# EAGLE design backplane (EAGLE 5.12)

## Sheet 1 of 3
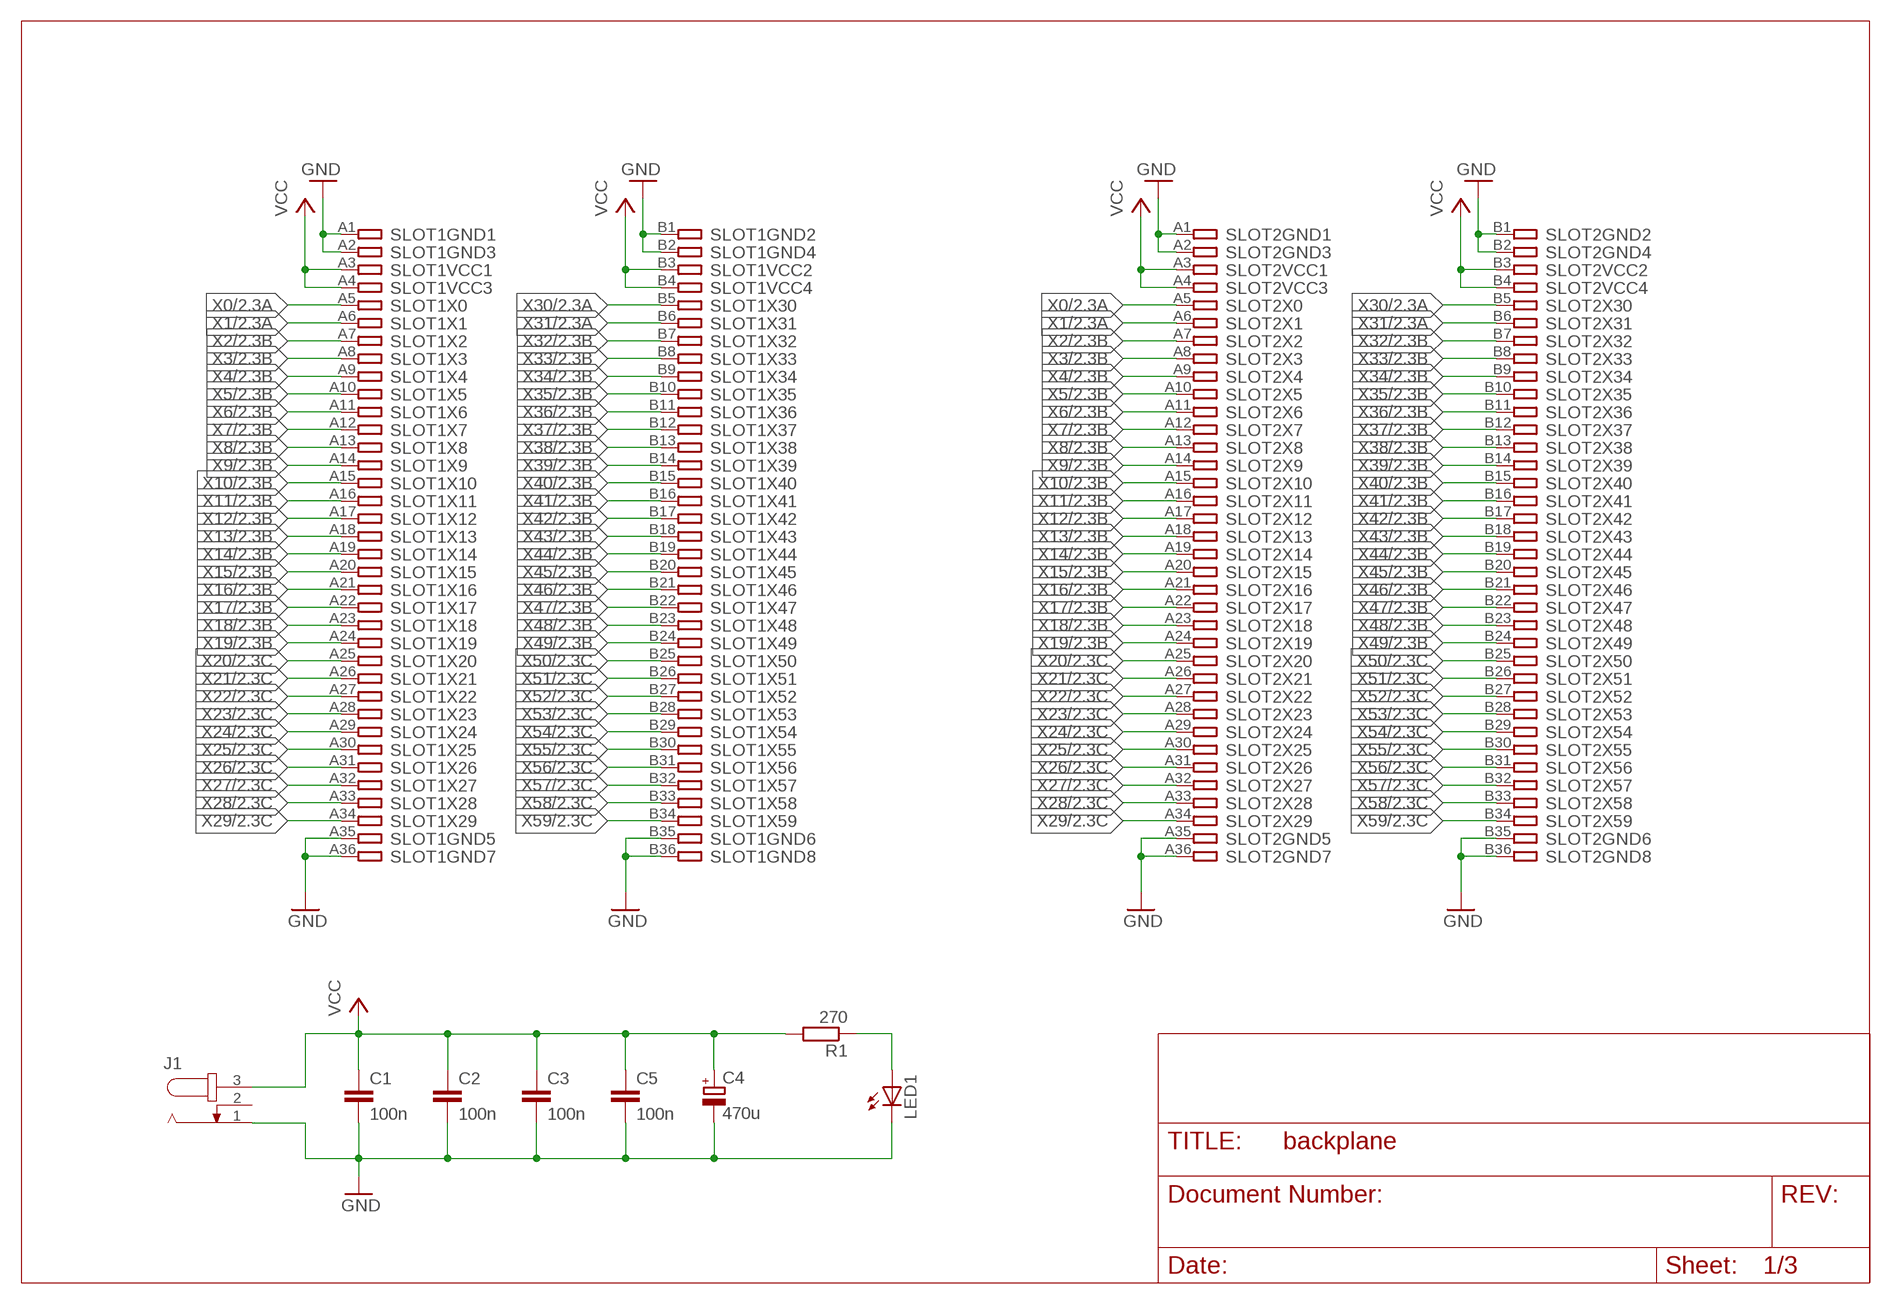
[diagram p0: schematic, sheet 1]

### Parts
C1  100n  C-EU050-024X044  [C050-024X044]
C2  100n  C-EU050-024X044  [C050-024X044]
C3  100n  C-EU050-024X044  [C050-024X044]
C4  470u  CPOL-EUE3.5-8  [E3,5-8]
C5  100n  C-EU050-024X044  [C050-024X044]
J1  JACK-PLUG0  [SPC4077]
LED1  LED5MM  [LED5MM]
R1  270  R-EU_0207/7  [0207/7]
SLOT1  MINI8086_SLOT  [CON-72]
SLOT2  MINI8086_SLOT  [CON-72]

### Nets
GND: C1.2 C2.2 C3.2 C4.- C5.2 J1.1 LED1.K(C) SLOT1.A1 SLOT1.A2 SLOT1.A35 SLOT1.A36 SLOT1.B1 SLOT1.B2 SLOT1.B35 SLOT1.B36 SLOT2.A1 SLOT2.A2 SLOT2.A35 SLOT2.A36 SLOT2.B1 SLOT2.B2 SLOT2.B35 SLOT2.B36 ; also sheet 2,3
N$3: LED1.A R1.1
VCC: C1.1 C2.1 C3.1 C4.+ C5.1 J1.3 R1.2 SLOT1.A3 SLOT1.A4 SLOT1.B3 SLOT1.B4 SLOT2.A3 SLOT2.A4 SLOT2.B3 SLOT2.B4 ; also sheet 2,3
X0: SLOT1.A5 SLOT2.A5 ; also sheet 2,3
X1: SLOT1.A6 SLOT2.A6 ; also sheet 2,3
X2: SLOT1.A7 SLOT2.A7 ; also sheet 2,3
X3: SLOT1.A8 SLOT2.A8 ; also sheet 2,3
X4: SLOT1.A9 SLOT2.A9 ; also sheet 2,3
X5: SLOT1.A10 SLOT2.A10 ; also sheet 2,3
X6: SLOT1.A11 SLOT2.A11 ; also sheet 2,3
X7: SLOT1.A12 SLOT2.A12 ; also sheet 2,3
X8: SLOT1.A13 SLOT2.A13 ; also sheet 2,3
X9: SLOT1.A14 SLOT2.A14 ; also sheet 2,3
X10: SLOT1.A15 SLOT2.A15 ; also sheet 2,3
X11: SLOT1.A16 SLOT2.A16 ; also sheet 2,3
X12: SLOT1.A17 SLOT2.A17 ; also sheet 2,3
X13: SLOT1.A18 SLOT2.A18 ; also sheet 2,3
X14: SLOT1.A19 SLOT2.A19 ; also sheet 2,3
X15: SLOT1.A20 SLOT2.A20 ; also sheet 2,3
X16: SLOT1.A21 SLOT2.A21 ; also sheet 2,3
X17: SLOT1.A22 SLOT2.A22 ; also sheet 2,3
X18: SLOT1.A23 SLOT2.A23 ; also sheet 2,3
X19: SLOT1.A24 SLOT2.A24 ; also sheet 2,3
X20: SLOT1.A25 SLOT2.A25 ; also sheet 2,3
X21: SLOT1.A26 SLOT2.A26 ; also sheet 2,3
X22: SLOT1.A27 SLOT2.A27 ; also sheet 2,3
X23: SLOT1.A28 SLOT2.A28 ; also sheet 2,3
X24: SLOT1.A29 SLOT2.A29 ; also sheet 2,3
X25: SLOT1.A30 SLOT2.A30 ; also sheet 2,3
X26: SLOT1.A31 SLOT2.A31 ; also sheet 2,3
X27: SLOT1.A32 SLOT2.A32 ; also sheet 2,3
X28: SLOT1.A33 SLOT2.A33 ; also sheet 2,3
X29: SLOT1.A34 SLOT2.A34 ; also sheet 2,3
X30: SLOT1.B5 SLOT2.B5 ; also sheet 2,3
X31: SLOT1.B6 SLOT2.B6 ; also sheet 2,3
X32: SLOT1.B7 SLOT2.B7 ; also sheet 2,3
X33: SLOT1.B8 SLOT2.B8 ; also sheet 2,3
X34: SLOT1.B9 SLOT2.B9 ; also sheet 2,3
X35: SLOT1.B10 SLOT2.B10 ; also sheet 2,3
X36: SLOT1.B11 SLOT2.B11 ; also sheet 2,3
X37: SLOT1.B12 SLOT2.B12 ; also sheet 2,3
X38: SLOT1.B13 SLOT2.B13 ; also sheet 2,3
X39: SLOT1.B14 SLOT2.B14 ; also sheet 2,3
X40: SLOT1.B15 SLOT2.B15 ; also sheet 2,3
X41: SLOT1.B16 SLOT2.B16 ; also sheet 2,3
X42: SLOT1.B17 SLOT2.B17 ; also sheet 2,3
X43: SLOT1.B18 SLOT2.B18 ; also sheet 2,3
X44: SLOT1.B19 SLOT2.B19 ; also sheet 2,3
X45: SLOT1.B20 SLOT2.B20 ; also sheet 2,3
X46: SLOT1.B21 SLOT2.B21 ; also sheet 2,3
X47: SLOT1.B22 SLOT2.B22 ; also sheet 2,3
X48: SLOT1.B23 SLOT2.B23 ; also sheet 2,3
X49: SLOT1.B24 SLOT2.B24 ; also sheet 2,3
X50: SLOT1.B25 SLOT2.B25 ; also sheet 2,3
X51: SLOT1.B26 SLOT2.B26 ; also sheet 2,3
X52: SLOT1.B27 SLOT2.B27 ; also sheet 2,3
X53: SLOT1.B28 SLOT2.B28 ; also sheet 2,3
X54: SLOT1.B29 SLOT2.B29 ; also sheet 2,3
X55: SLOT1.B30 SLOT2.B30 ; also sheet 2,3
X56: SLOT1.B31 SLOT2.B31 ; also sheet 2,3
X57: SLOT1.B32 SLOT2.B32 ; also sheet 2,3
X58: SLOT1.B33 SLOT2.B33 ; also sheet 2,3
X59: SLOT1.B34 SLOT2.B34 ; also sheet 2,3
Unconnected: J1.2

## Sheet 2 of 3
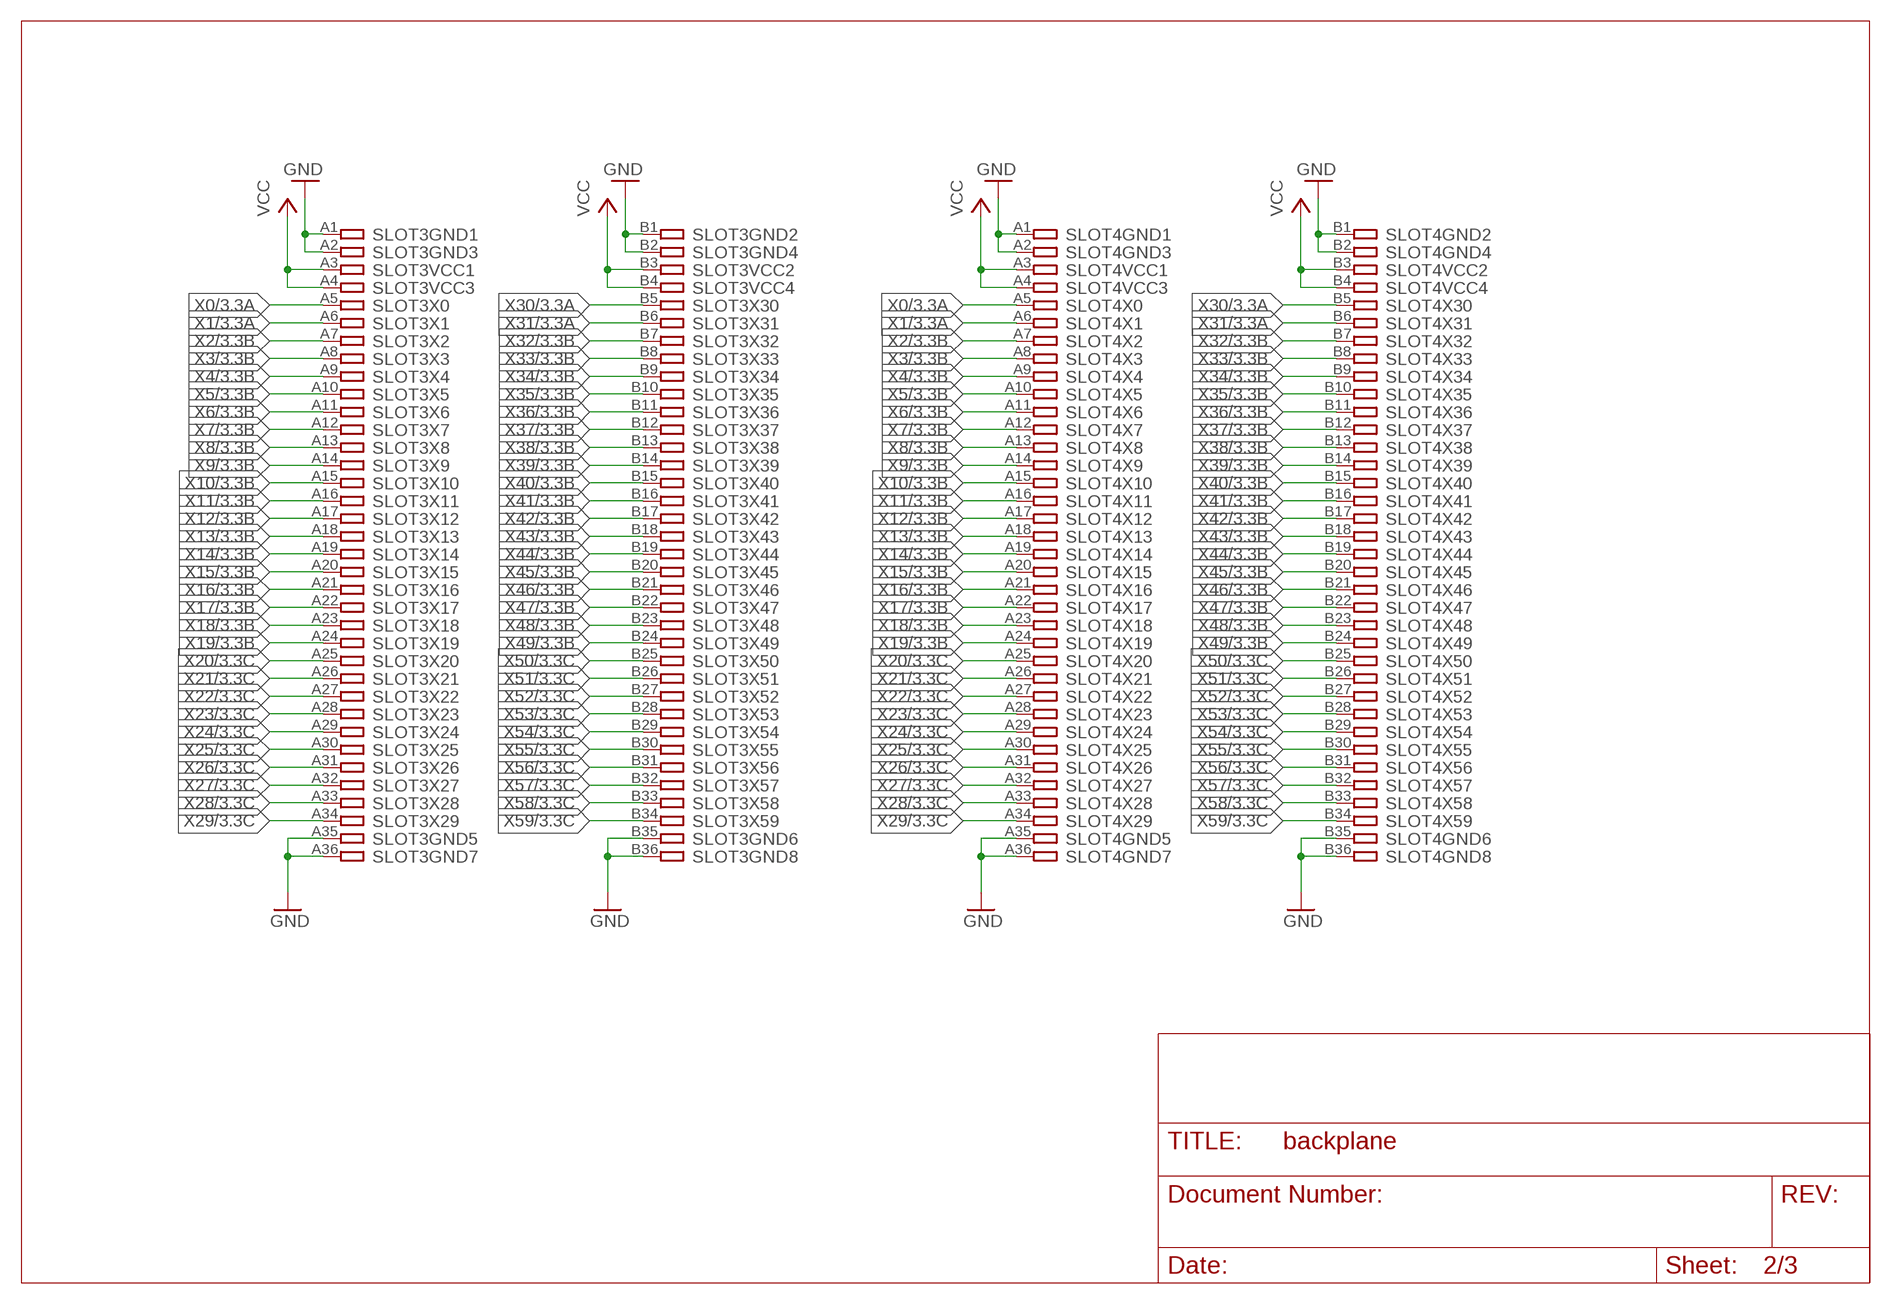
[diagram p1: schematic, sheet 2]

### Parts
SLOT3  MINI8086_SLOT  [CON-72]
SLOT4  MINI8086_SLOT  [CON-72]

### Nets
GND: SLOT3.A1 SLOT3.A2 SLOT3.A35 SLOT3.A36 SLOT3.B1 SLOT3.B2 SLOT3.B35 SLOT3.B36 SLOT4.A1 SLOT4.A2 SLOT4.A35 SLOT4.A36 SLOT4.B1 SLOT4.B2 SLOT4.B35 SLOT4.B36 ; also sheet 1,3
VCC: SLOT3.A3 SLOT3.A4 SLOT3.B3 SLOT3.B4 SLOT4.A3 SLOT4.A4 SLOT4.B3 SLOT4.B4 ; also sheet 1,3
X0: SLOT3.A5 SLOT4.A5 ; also sheet 1,3
X1: SLOT3.A6 SLOT4.A6 ; also sheet 1,3
X2: SLOT3.A7 SLOT4.A7 ; also sheet 1,3
X3: SLOT3.A8 SLOT4.A8 ; also sheet 1,3
X4: SLOT3.A9 SLOT4.A9 ; also sheet 1,3
X5: SLOT3.A10 SLOT4.A10 ; also sheet 1,3
X6: SLOT3.A11 SLOT4.A11 ; also sheet 1,3
X7: SLOT3.A12 SLOT4.A12 ; also sheet 1,3
X8: SLOT3.A13 SLOT4.A13 ; also sheet 1,3
X9: SLOT3.A14 SLOT4.A14 ; also sheet 1,3
X10: SLOT3.A15 SLOT4.A15 ; also sheet 1,3
X11: SLOT3.A16 SLOT4.A16 ; also sheet 1,3
X12: SLOT3.A17 SLOT4.A17 ; also sheet 1,3
X13: SLOT3.A18 SLOT4.A18 ; also sheet 1,3
X14: SLOT3.A19 SLOT4.A19 ; also sheet 1,3
X15: SLOT3.A20 SLOT4.A20 ; also sheet 1,3
X16: SLOT3.A21 SLOT4.A21 ; also sheet 1,3
X17: SLOT3.A22 SLOT4.A22 ; also sheet 1,3
X18: SLOT3.A23 SLOT4.A23 ; also sheet 1,3
X19: SLOT3.A24 SLOT4.A24 ; also sheet 1,3
X20: SLOT3.A25 SLOT4.A25 ; also sheet 1,3
X21: SLOT3.A26 SLOT4.A26 ; also sheet 1,3
X22: SLOT3.A27 SLOT4.A27 ; also sheet 1,3
X23: SLOT3.A28 SLOT4.A28 ; also sheet 1,3
X24: SLOT3.A29 SLOT4.A29 ; also sheet 1,3
X25: SLOT3.A30 SLOT4.A30 ; also sheet 1,3
X26: SLOT3.A31 SLOT4.A31 ; also sheet 1,3
X27: SLOT3.A32 SLOT4.A32 ; also sheet 1,3
X28: SLOT3.A33 SLOT4.A33 ; also sheet 1,3
X29: SLOT3.A34 SLOT4.A34 ; also sheet 1,3
X30: SLOT3.B5 SLOT4.B5 ; also sheet 1,3
X31: SLOT3.B6 SLOT4.B6 ; also sheet 1,3
X32: SLOT3.B7 SLOT4.B7 ; also sheet 1,3
X33: SLOT3.B8 SLOT4.B8 ; also sheet 1,3
X34: SLOT3.B9 SLOT4.B9 ; also sheet 1,3
X35: SLOT3.B10 SLOT4.B10 ; also sheet 1,3
X36: SLOT3.B11 SLOT4.B11 ; also sheet 1,3
X37: SLOT3.B12 SLOT4.B12 ; also sheet 1,3
X38: SLOT3.B13 SLOT4.B13 ; also sheet 1,3
X39: SLOT3.B14 SLOT4.B14 ; also sheet 1,3
X40: SLOT3.B15 SLOT4.B15 ; also sheet 1,3
X41: SLOT3.B16 SLOT4.B16 ; also sheet 1,3
X42: SLOT3.B17 SLOT4.B17 ; also sheet 1,3
X43: SLOT3.B18 SLOT4.B18 ; also sheet 1,3
X44: SLOT3.B19 SLOT4.B19 ; also sheet 1,3
X45: SLOT3.B20 SLOT4.B20 ; also sheet 1,3
X46: SLOT3.B21 SLOT4.B21 ; also sheet 1,3
X47: SLOT3.B22 SLOT4.B22 ; also sheet 1,3
X48: SLOT3.B23 SLOT4.B23 ; also sheet 1,3
X49: SLOT3.B24 SLOT4.B24 ; also sheet 1,3
X50: SLOT3.B25 SLOT4.B25 ; also sheet 1,3
X51: SLOT3.B26 SLOT4.B26 ; also sheet 1,3
X52: SLOT3.B27 SLOT4.B27 ; also sheet 1,3
X53: SLOT3.B28 SLOT4.B28 ; also sheet 1,3
X54: SLOT3.B29 SLOT4.B29 ; also sheet 1,3
X55: SLOT3.B30 SLOT4.B30 ; also sheet 1,3
X56: SLOT3.B31 SLOT4.B31 ; also sheet 1,3
X57: SLOT3.B32 SLOT4.B32 ; also sheet 1,3
X58: SLOT3.B33 SLOT4.B33 ; also sheet 1,3
X59: SLOT3.B34 SLOT4.B34 ; also sheet 1,3

## Sheet 3 of 3
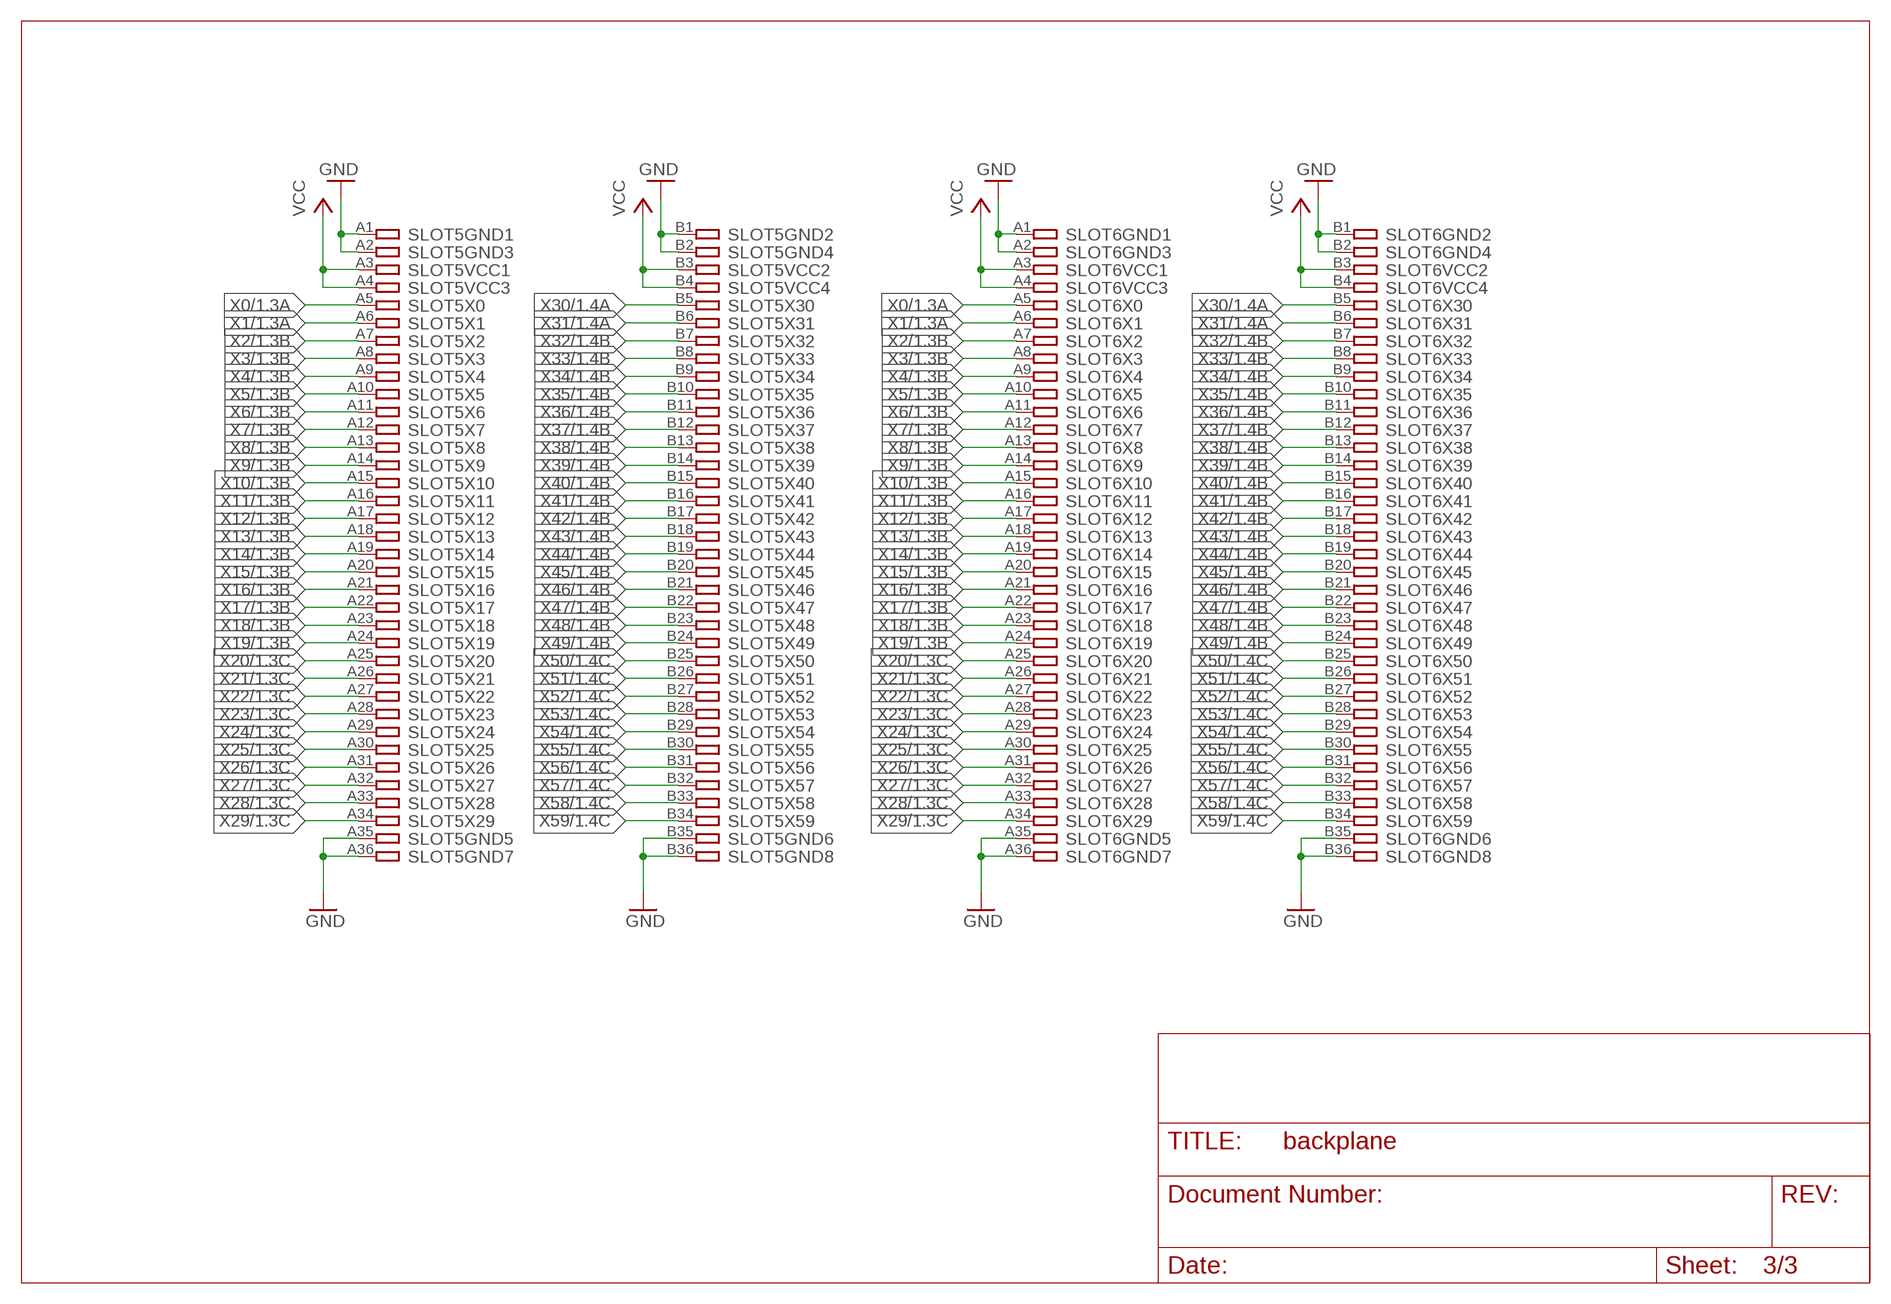
[diagram p2: schematic, sheet 3]

### Parts
SLOT5  MINI8086_SLOT  [CON-72]
SLOT6  MINI8086_SLOT  [CON-72]

### Nets
GND: SLOT5.A1 SLOT5.A2 SLOT5.A35 SLOT5.A36 SLOT5.B1 SLOT5.B2 SLOT5.B35 SLOT5.B36 SLOT6.A1 SLOT6.A2 SLOT6.A35 SLOT6.A36 SLOT6.B1 SLOT6.B2 SLOT6.B35 SLOT6.B36 ; also sheet 1,2
VCC: SLOT5.A3 SLOT5.A4 SLOT5.B3 SLOT5.B4 SLOT6.A3 SLOT6.A4 SLOT6.B3 SLOT6.B4 ; also sheet 1,2
X0: SLOT5.A5 SLOT6.A5 ; also sheet 1,2
X1: SLOT5.A6 SLOT6.A6 ; also sheet 1,2
X2: SLOT5.A7 SLOT6.A7 ; also sheet 1,2
X3: SLOT5.A8 SLOT6.A8 ; also sheet 1,2
X4: SLOT5.A9 SLOT6.A9 ; also sheet 1,2
X5: SLOT5.A10 SLOT6.A10 ; also sheet 1,2
X6: SLOT5.A11 SLOT6.A11 ; also sheet 1,2
X7: SLOT5.A12 SLOT6.A12 ; also sheet 1,2
X8: SLOT5.A13 SLOT6.A13 ; also sheet 1,2
X9: SLOT5.A14 SLOT6.A14 ; also sheet 1,2
X10: SLOT5.A15 SLOT6.A15 ; also sheet 1,2
X11: SLOT5.A16 SLOT6.A16 ; also sheet 1,2
X12: SLOT5.A17 SLOT6.A17 ; also sheet 1,2
X13: SLOT5.A18 SLOT6.A18 ; also sheet 1,2
X14: SLOT5.A19 SLOT6.A19 ; also sheet 1,2
X15: SLOT5.A20 SLOT6.A20 ; also sheet 1,2
X16: SLOT5.A21 SLOT6.A21 ; also sheet 1,2
X17: SLOT5.A22 SLOT6.A22 ; also sheet 1,2
X18: SLOT5.A23 SLOT6.A23 ; also sheet 1,2
X19: SLOT5.A24 SLOT6.A24 ; also sheet 1,2
X20: SLOT5.A25 SLOT6.A25 ; also sheet 1,2
X21: SLOT5.A26 SLOT6.A26 ; also sheet 1,2
X22: SLOT5.A27 SLOT6.A27 ; also sheet 1,2
X23: SLOT5.A28 SLOT6.A28 ; also sheet 1,2
X24: SLOT5.A29 SLOT6.A29 ; also sheet 1,2
X25: SLOT5.A30 SLOT6.A30 ; also sheet 1,2
X26: SLOT5.A31 SLOT6.A31 ; also sheet 1,2
X27: SLOT5.A32 SLOT6.A32 ; also sheet 1,2
X28: SLOT5.A33 SLOT6.A33 ; also sheet 1,2
X29: SLOT5.A34 SLOT6.A34 ; also sheet 1,2
X30: SLOT5.B5 SLOT6.B5 ; also sheet 1,2
X31: SLOT5.B6 SLOT6.B6 ; also sheet 1,2
X32: SLOT5.B7 SLOT6.B7 ; also sheet 1,2
X33: SLOT5.B8 SLOT6.B8 ; also sheet 1,2
X34: SLOT5.B9 SLOT6.B9 ; also sheet 1,2
X35: SLOT5.B10 SLOT6.B10 ; also sheet 1,2
X36: SLOT5.B11 SLOT6.B11 ; also sheet 1,2
X37: SLOT5.B12 SLOT6.B12 ; also sheet 1,2
X38: SLOT5.B13 SLOT6.B13 ; also sheet 1,2
X39: SLOT5.B14 SLOT6.B14 ; also sheet 1,2
X40: SLOT5.B15 SLOT6.B15 ; also sheet 1,2
X41: SLOT5.B16 SLOT6.B16 ; also sheet 1,2
X42: SLOT5.B17 SLOT6.B17 ; also sheet 1,2
X43: SLOT5.B18 SLOT6.B18 ; also sheet 1,2
X44: SLOT5.B19 SLOT6.B19 ; also sheet 1,2
X45: SLOT5.B20 SLOT6.B20 ; also sheet 1,2
X46: SLOT5.B21 SLOT6.B21 ; also sheet 1,2
X47: SLOT5.B22 SLOT6.B22 ; also sheet 1,2
X48: SLOT5.B23 SLOT6.B23 ; also sheet 1,2
X49: SLOT5.B24 SLOT6.B24 ; also sheet 1,2
X50: SLOT5.B25 SLOT6.B25 ; also sheet 1,2
X51: SLOT5.B26 SLOT6.B26 ; also sheet 1,2
X52: SLOT5.B27 SLOT6.B27 ; also sheet 1,2
X53: SLOT5.B28 SLOT6.B28 ; also sheet 1,2
X54: SLOT5.B29 SLOT6.B29 ; also sheet 1,2
X55: SLOT5.B30 SLOT6.B30 ; also sheet 1,2
X56: SLOT5.B31 SLOT6.B31 ; also sheet 1,2
X57: SLOT5.B32 SLOT6.B32 ; also sheet 1,2
X58: SLOT5.B33 SLOT6.B33 ; also sheet 1,2
X59: SLOT5.B34 SLOT6.B34 ; also sheet 1,2

## Library data of the parts
C1-C3 C5 = rcl:C-EU: CAPACITOR, European symbol
C4 = rcl:CPOL-EU: POLARIZED CAPACITOR, European symbol
J1 = con-jack:JACK-PLUG: DC POWER JACK Power Jack, DC, Right Angle, Through Hole, Rated 5A at 16VDC, PC Terminals Distributor: Farnell (www.Farnell.de) Drawing: 84N1161.pdf / 84N1162.pdf Manufacturer: SPC Technology (www.spctechnology.com) Type: SPC4077 / SPC 4078; OC_FARNELL: unknown; OC_NEWARK: unknown
LED1 = led:LED: LED OSRAM: - CHIPLED LG R971, LG N971, LY N971, LG Q971, LY Q971, LO R971, LY R971 LH N974, LH R974 LS Q976, LO Q976, LY Q976 LO Q996 - Hyper CHIPLED LW Q18S LB Q993, LB Q99A, LB R99A - SideLED LS A670, LO A670, LY A670, LG A670, LP A670 LB A673, LV A673, LT A673, LW A673 LH A674 LY A675 LS A676, LA A676, LO A676, LY A676, LW A676 LS A679, LY A679, LG A679 - Hyper Micro SIDELED® LS Y876, LA Y876, LO Y876, LY Y876 LT Y87S - SmartLED LW L88C, LW L88S LB L89C, LB L89S, LG L890 LS L89K, LO L89K, LY L89K LS L896, LA L896, LO L896, LY L896 - TOPLED LS T670, LO T670, LY T670, LG T670, LP T670 LSG T670, LSP T670, LSY T670, LOP T670, LYG T670 LG T671, LOG T671, LSG T671 LB T673, LV T673, LT T673, LW T673 LH T674 LS T676, LA T676, LO T676, LY T676, LB T676, LH T676, LSB T676, LW T676 LB T67C, LV T67C, LT T67C, LS T67K, LO T67K, LY T67K, LW E67C LS E67B, LA E67B, LO E67B, LY E67B, LB E67C, LV E67C, LT E67C LW T67C LS T679, LY T679, LG T679 LS T770, LO T770, LY T770, LG T770, LP T770 LB T773, LV T773, LT T773, LW T773 LH T774 LS E675, LA E675, LY E675, LS T675 LS T776, LA T776, LO T776, LY T776, LB T776 LHGB T686 LT T68C, LB T68C - Hyper Mini TOPLED® LB M676 - Mini TOPLED Santana® LG M470 LS M47K, LO M47K, LY M47K Source: http://www.osram.convergy.de LUXEON: - LUMILED® LXK2-PW12-R00, LXK2-PW12-S00, LXK2-PW14-U00, LXK2-PW14-V00 LXK2-PM12-R00, LXK2-PM12-S00, LXK2-PM14-U00 LXK2-PE12-Q00, LXK2-PE12-R00, LXK2-PE12-S00, LXK2-PE14-T00, LXK2-PE14-U00 LXK2-PB12-K00, LXK2-PB12-L00, LXK2-PB12-M00, LXK2-PB14-N00, LXK2-PB14-P00, LXK2-PB14-Q00 LXK2-PR12-L00, LXK2-PR12-M00, LXK2-PR14-Q00, LXK2-PR14-R00 LXK2-PD12-Q00, LXK2-PD12-R00, LXK2-PD12-S00 LXK2-PH12-R00, LXK2-PH12-S00 LXK2-PL12-P00, LXK2-PL12-Q00, LXK2-PL12-R00 Source: www.luxeon.com KINGBRIGHT: KA-3528ASYC Source: www.kingbright.com
R1 = rcl:R-EU_: RESISTOR, European symbol
SLOT1-SLOT6 = con-mini8086:MINI8086_SLOT: Mini8086 slot connector

## Board
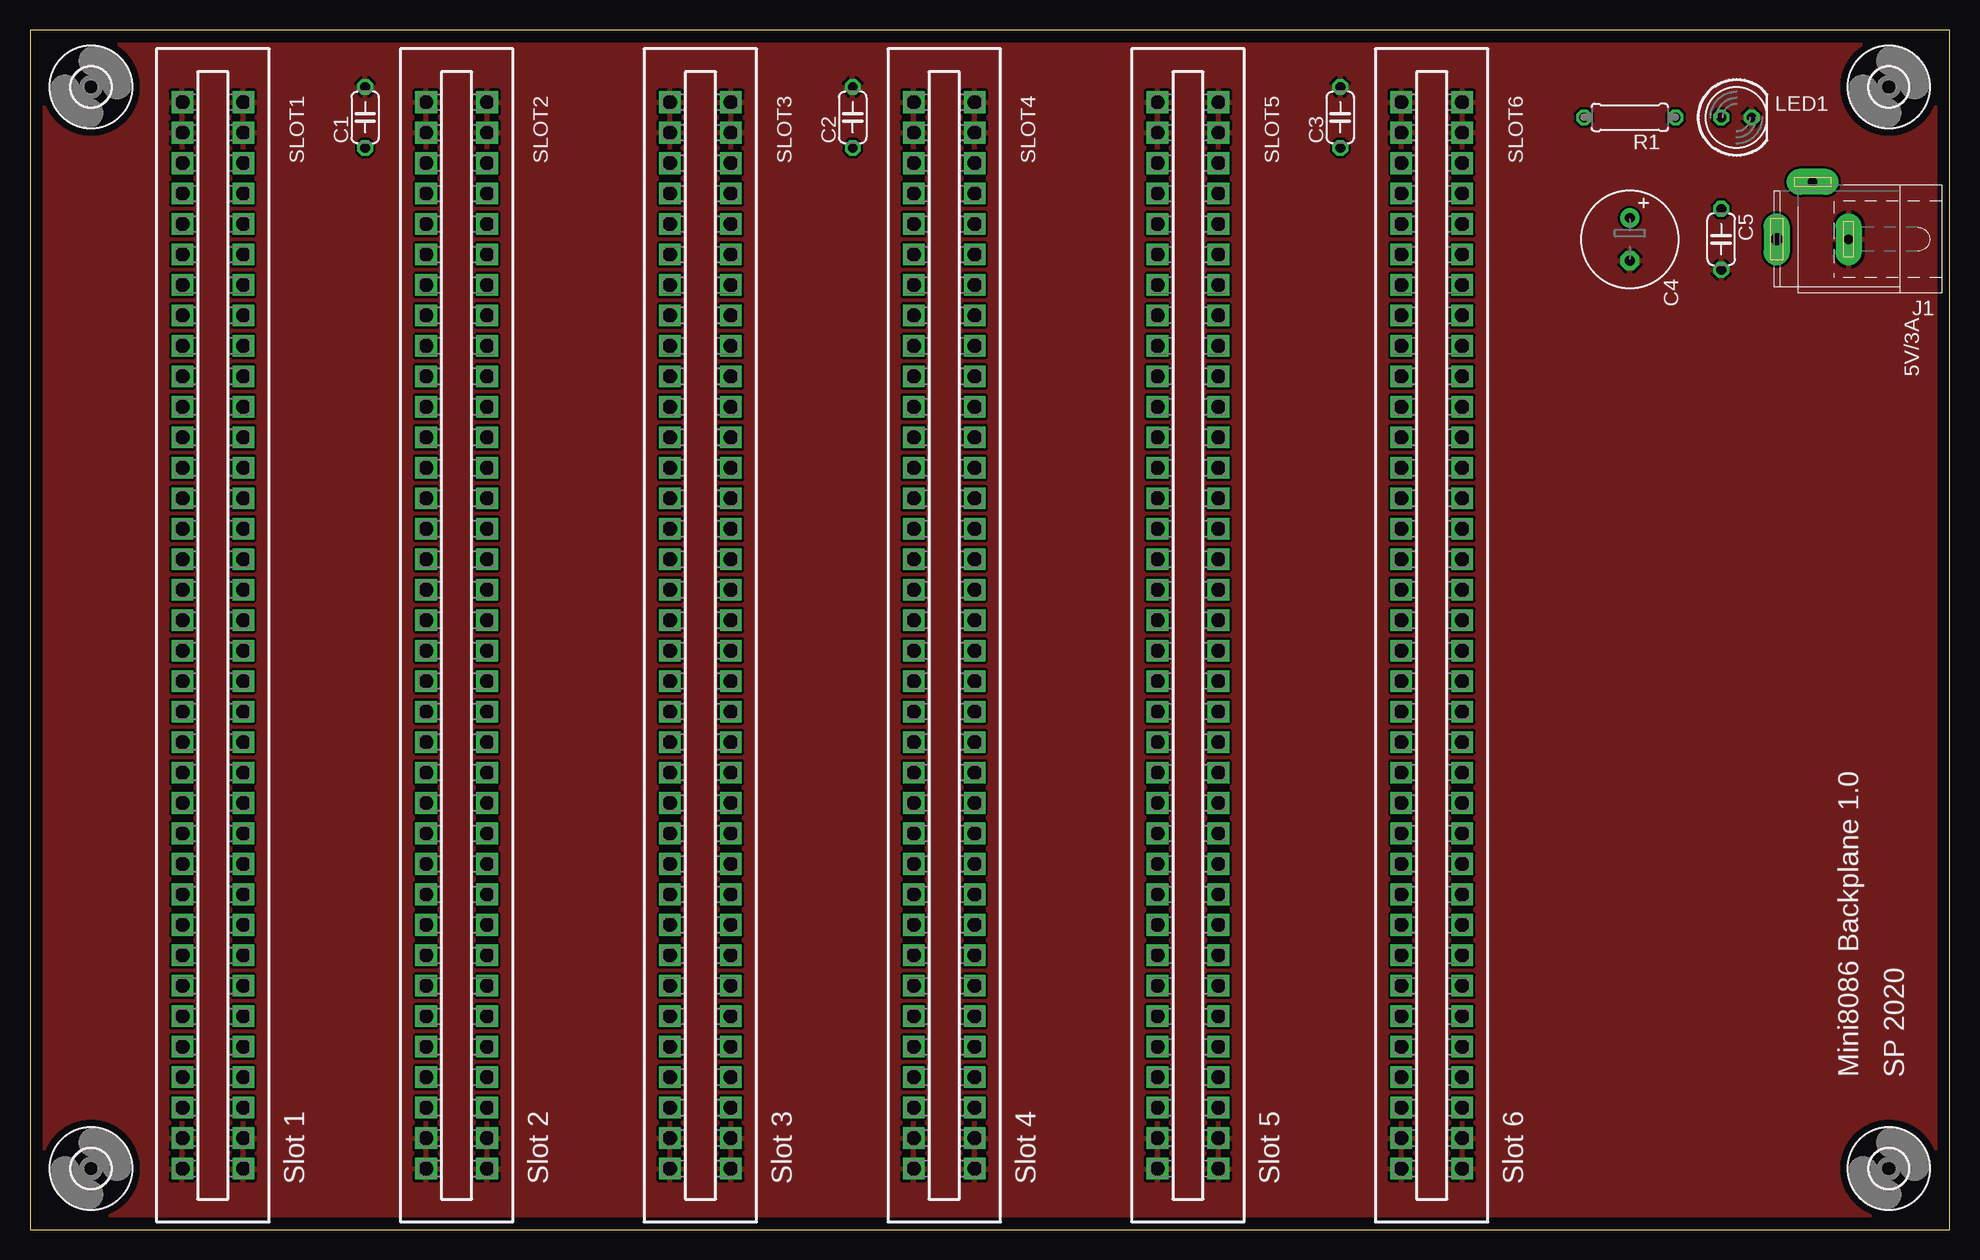
[diagram p3: board, top side]
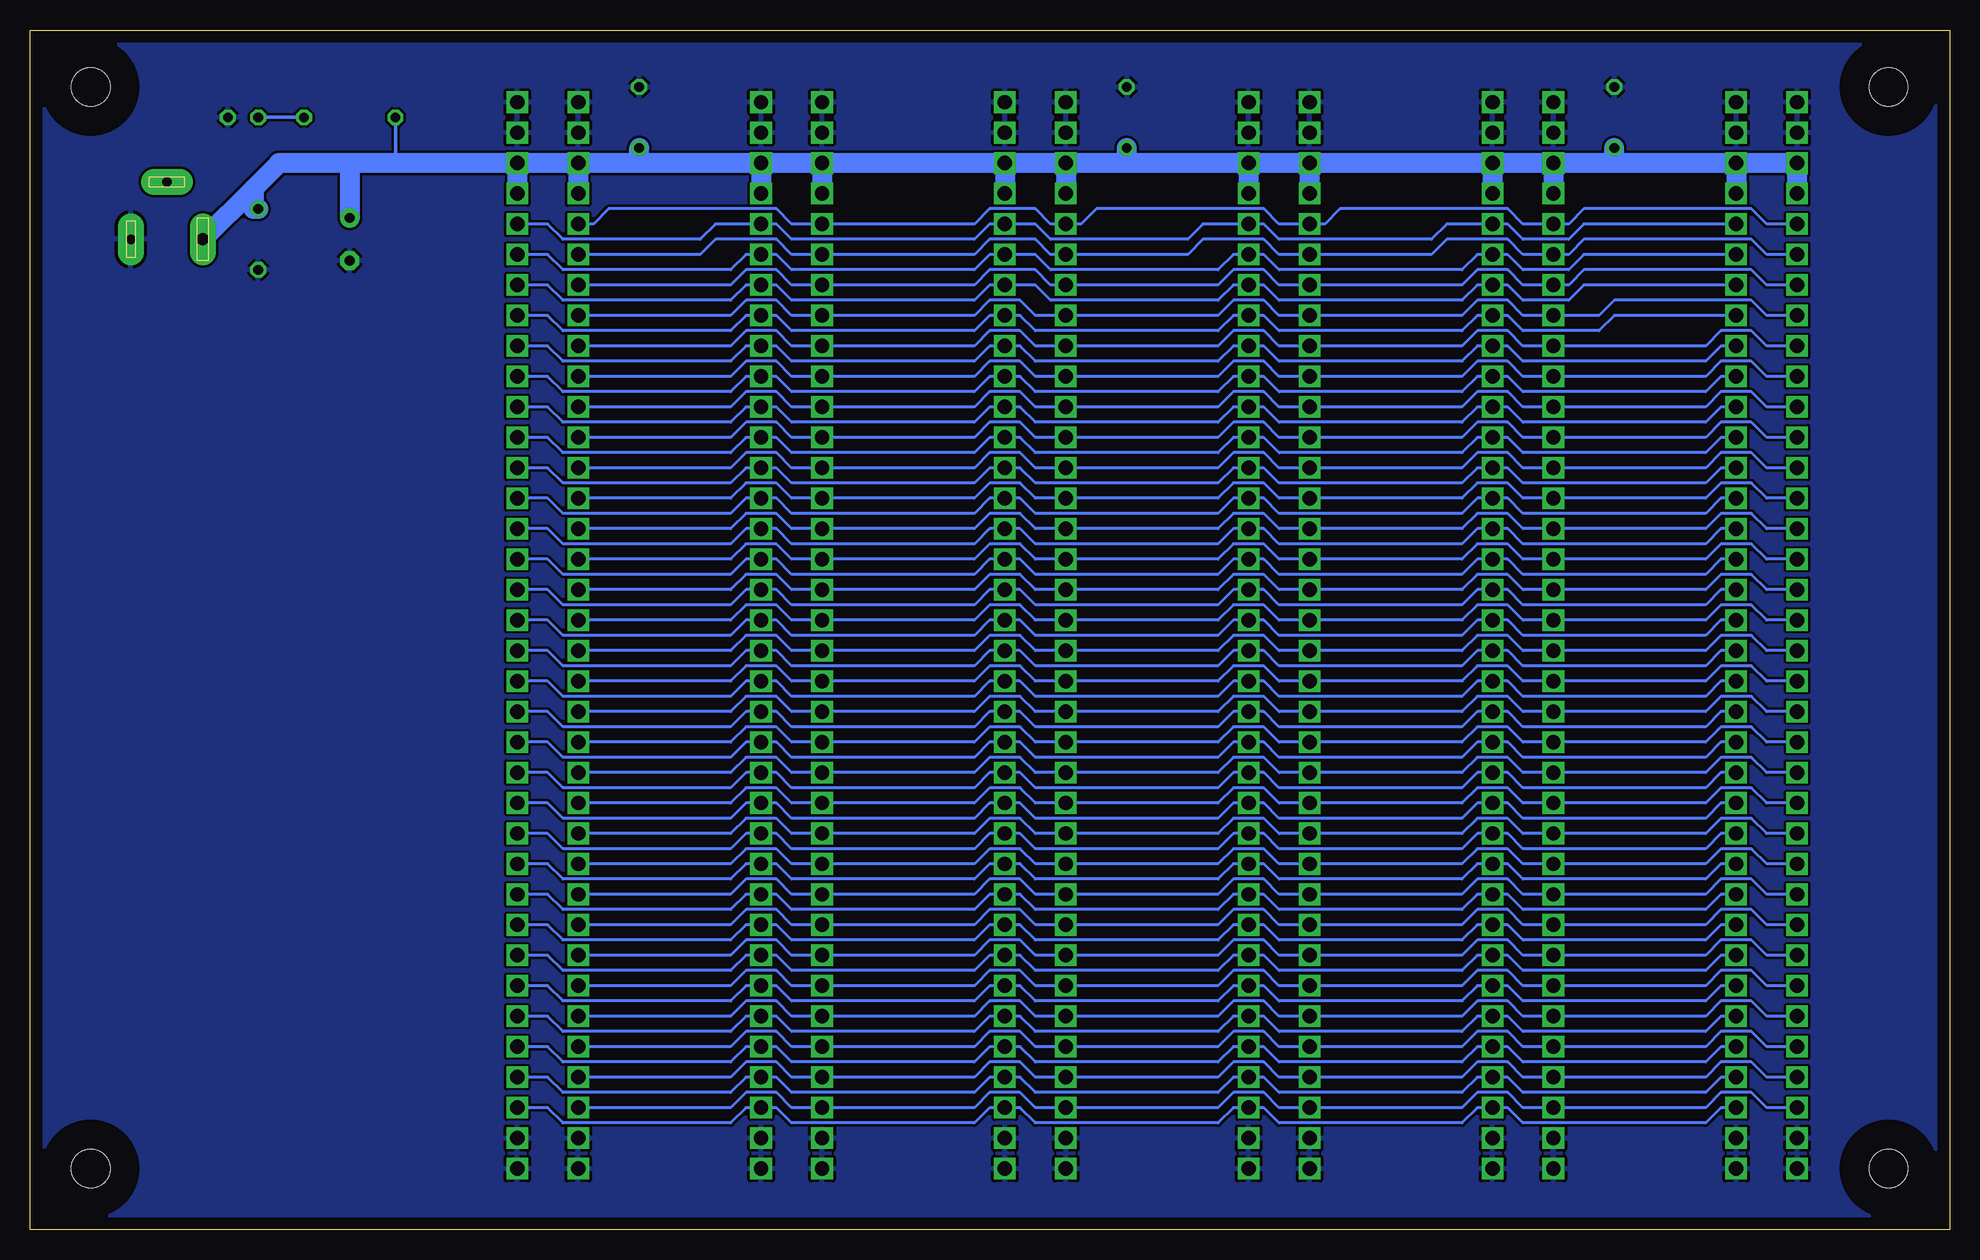
[diagram p4: board, bottom side, seen from below]

Size 160 x 100 mm. Coordinates in mm from the lower left corner, seen from the top.
Outline: 0,0 160,0 160,100 0,100 0,0
Copper layers (1*16): Top 0.035mm / dielectric 1.5mm / Bottom 0.035mm
Design rules "default": minimum track width 10mil, minimum drill 24mil, track to track 8mil, track to pad 8mil, pad to pad 8mil, via to via 8mil, smd to smd 8mil, copper to edge 40mil, drill to drill 8mil, minimum pad ring 10mil, minimum via ring 8mil, stop-mask expansion 4mil, vias tented up to drill 0mil, thermal gap 10mil

### Footprints (pad centres in the part's own frame; a part is rotated, then mirrored left to right if it is on the bottom)
C050-024X044 = drill 0.813 octagon: 1 -2.54,0; 2 2.54,0
E3,5-8 = drill 0.813 pad 1.6 round: + -1.778,0 | drill 0.813 pad 1.6 octagon: - 1.778,0
SPC4077 = drill 0.8 pad 2.184 long: 1 -3,0; 2 0,-4.8 | drill 1 pad 2.184 long: 3 3,0
LED5MM = drill 0.813 octagon: A -1.27,0; K 1.27,0
0207/7 = drill 0.813 octagon: 1 -3.81,0; 2 3.81,0
CON-72 = drill 1.2 pad 1.778 square: A1 81.28,-2.54; A2 78.74,-2.54; A3 76.2,-2.54; A4 73.66,-2.54; A5 71.12,-2.54; A6 68.58,-2.54; A7 66.04,-2.54; A8 63.5,-2.54; A9 60.96,-2.54; A10 58.42,-2.54; A11 55.88,-2.54; A12 53.34,-2.54; A13 50.8,-2.54; A14 48.26,-2.54; A15 45.72,-2.54; A16 43.18,-2.54; A17 40.64,-2.54; A18 38.1,-2.54; A19 35.56,-2.54; A20 33.02,-2.54; A21 30.48,-2.54; A22 27.94,-2.54; A23 25.4,-2.54; A24 22.86,-2.54; A25 20.32,-2.54; A26 17.78,-2.54; A27 15.24,-2.54; A28 12.7,-2.54; A29 10.16,-2.54; A30 7.62,-2.54; A31 5.08,-2.54; A32 2.54,-2.54; A33 0,-2.54; A34 -2.54,-2.54; A35 -5.08,-2.54; A36 -7.62,-2.54; B1 81.28,2.54; B2 78.74,2.54; B3 76.2,2.54; B4 73.66,2.54; B5 71.12,2.54; B6 68.58,2.54; B7 66.04,2.54; B8 63.5,2.54; B9 60.96,2.54; B10 58.42,2.54; B11 55.88,2.54; B12 53.34,2.54; B13 50.8,2.54; B14 48.26,2.54; B15 45.72,2.54; B16 43.18,2.54; B17 40.64,2.54; B18 38.1,2.54; B19 35.56,2.54; B20 33.02,2.54; B21 30.48,2.54; B22 27.94,2.54; B23 25.4,2.54; B24 22.86,2.54; B25 20.32,2.54; B26 17.78,2.54; B27 15.24,2.54; B28 12.7,2.54; B29 10.16,2.54; B30 7.62,2.54; B31 5.08,2.54; B32 2.54,2.54; B33 0,2.54; B34 -2.54,2.54; B35 -5.08,2.54; B36 -7.62,2.54
3,2 = hole 3.2: 0,0

### Placement (x,y rotation side)
C1  27.94,92.71 90 top
C2  68.58,92.71 90 top
C3  109.22,92.71 90 top
C4  133.35,82.55 270 top
C5  140.97,82.55 270 top
J1  148.59,82.55 180 top
LED1  142.24,92.71 0 top
R1  133.35,92.71 180 top
SLOT1  15.24,12.7 90 top
SLOT2  35.56,12.7 90 top
SLOT3  55.88,12.7 90 top
SLOT4  76.2,12.7 90 top
SLOT5  96.52,12.7 90 top
SLOT6  116.84,12.7 90 top
U$1  [3,2]  5.08,95.25 0 top
U$2  [3,2]  5.08,5.08 0 top
U$3  [3,2]  154.94,95.25 0 top
U$4  [3,2]  154.94,5.08 0 top

### Tracks (layer width: path | path; a pad name or v marks a point on that pad's centre or on a via)
GND
  pour Bottom: 0,100.33 160.02,100.33 160.02,0 0,0
  pour Top: 0,100.33 160.02,100.33 160.02,0 0,0
N$3
  Bottom 0.305: R1.1 LED1.A
VCC
  Bottom 0.305: 129.54,88.9 R1.2
  Bottom 1.676: SLOT1.B4 SLOT1.B3 SLOT1.A3 | SLOT1.A3 SLOT1.A4 | SLOT1.A3 27.94,88.9 | 27.94,88.9 SLOT2.B3 | SLOT2.B3 SLOT2.A3 | SLOT2.B3 SLOT2.B4 | SLOT2.A3 SLOT2.A4 | SLOT2.A3 SLOT3.B3 | SLOT3.B3 SLOT3.B4 | SLOT3.B3 SLOT3.A3 | SLOT3.A3 SLOT3.A4 | SLOT3.A3 68.58,88.9 | 68.58,88.9 SLOT4.B3 | SLOT4.B3 SLOT4.B4 | SLOT4.A3 SLOT4.A4 | SLOT4.B3 SLOT4.A3 | SLOT4.A3 SLOT5.B3 | SLOT5.B3 SLOT5.A3 | SLOT5.A3 109.22,88.9 | 109.22,88.9 SLOT6.B3 | SLOT6.B3 SLOT6.A3 | SLOT6.A3 SLOT6.A4 | SLOT6.B3 SLOT6.B4 | SLOT5.A3 SLOT5.A4 | SLOT5.B3 SLOT5.B4 | 27.94,88.9 C1.1 | 68.58,88.9 C2.1 | 109.22,88.9 C3.1 | SLOT6.A3 129.54,88.9 133.35,88.9 | 133.35,88.9 139.24,88.9 141.38,86.77 | 141.38,86.77 J1.3 | 133.35,88.9 C4.+ | C5.1 141.38,85.09 141.38,86.77
X0
  Bottom 0.254: SLOT1.A5 30.48,83.82 31.75,82.55 35.56,82.55 36.83,83.82 SLOT2.A5 41.91,83.82 43.18,82.55 55.88,82.55 57.15,83.82 SLOT3.A5 62.23,83.82 63.5,82.55 74.93,82.55 76.2,83.82 SLOT4.A5 80.01,83.82 81.28,82.55 96.52,82.55 97.79,83.82 SLOT5.A5 102.87,83.82 104.14,82.55 115.57,82.55 116.84,83.82 SLOT6.A5
X1
  Bottom 0.254: SLOT1.A6 30.48,81.28 31.75,80.01 35.56,80.01 36.83,81.28 SLOT2.A6 39.37,81.28 40.64,80.01 55.88,80.01 57.15,81.28 SLOT3.A6 59.69,81.28 60.96,80.01 74.93,80.01 76.2,81.28 SLOT4.A6 80.01,81.28 81.28,80.01 96.52,80.01 97.79,81.28 SLOT5.A6 100.33,81.28 101.6,80.01 115.57,80.01 116.84,81.28 SLOT6.A6
X2
  Bottom 0.254: SLOT1.A7 30.48,78.74 31.75,77.47 35.56,77.47 36.83,78.74 SLOT2.A7 39.37,78.74 40.64,77.47 55.88,77.47 57.15,78.74 SLOT3.A7 59.69,78.74 60.96,77.47 74.93,77.47 76.2,78.74 SLOT4.A7 80.01,78.74 81.28,77.47 96.52,77.47 97.79,78.74 SLOT5.A7 100.33,78.74 101.6,77.47 115.57,77.47 116.84,78.74 SLOT6.A7
X3
  Bottom 0.254: SLOT1.A8 27.94,76.2 29.21,74.93 35.56,74.93 36.83,76.2 SLOT2.A8 39.37,76.2 40.64,74.93 55.88,74.93 57.15,76.2 SLOT3.A8 59.69,76.2 60.96,74.93 76.2,74.93 77.47,76.2 SLOT4.A8 80.01,76.2 81.28,74.93 96.52,74.93 97.79,76.2 SLOT5.A8 100.33,76.2 101.6,74.93 115.57,74.93 116.84,76.2 SLOT6.A8
X4
  Bottom 0.254: SLOT1.A9 19.05,73.66 20.32,72.39 35.56,72.39 36.83,73.66 SLOT2.A9 39.37,73.66 40.64,72.39 55.88,72.39 57.15,73.66 SLOT3.A9 59.69,73.66 60.96,72.39 76.2,72.39 77.47,73.66 SLOT4.A9 80.01,73.66 81.28,72.39 96.52,72.39 97.79,73.66 SLOT5.A9 100.33,73.66 101.6,72.39 115.57,72.39 116.84,73.66 SLOT6.A9
X5
  Bottom 0.254: SLOT1.A10 19.05,71.12 20.32,69.85 35.56,69.85 36.83,71.12 SLOT2.A10 39.37,71.12 40.64,69.85 55.88,69.85 57.15,71.12 SLOT3.A10 59.69,71.12 60.96,69.85 76.2,69.85 77.47,71.12 SLOT4.A10 80.01,71.12 81.28,69.85 96.52,69.85 97.79,71.12 SLOT5.A10 100.33,71.12 101.6,69.85 115.57,69.85 116.84,71.12 SLOT6.A10
X6
  Bottom 0.254: SLOT1.A11 19.05,68.58 20.32,67.31 35.56,67.31 36.83,68.58 SLOT2.A11 39.37,68.58 40.64,67.31 55.88,67.31 57.15,68.58 SLOT3.A11 59.69,68.58 60.96,67.31 76.2,67.31 77.47,68.58 SLOT4.A11 80.01,68.58 81.28,67.31 96.52,67.31 97.79,68.58 SLOT5.A11 100.33,68.58 101.6,67.31 115.57,67.31 116.84,68.58 SLOT6.A11
X7
  Bottom 0.254: SLOT1.A12 19.05,66.04 20.32,64.77 35.56,64.77 36.83,66.04 SLOT2.A12 39.37,66.04 40.64,64.77 55.88,64.77 57.15,66.04 SLOT3.A12 59.69,66.04 60.96,64.77 76.2,64.77 77.47,66.04 SLOT4.A12 80.01,66.04 81.28,64.77 96.52,64.77 97.79,66.04 SLOT5.A12 100.33,66.04 101.6,64.77 115.57,64.77 116.84,66.04 SLOT6.A12
X8
  Bottom 0.254: SLOT1.A13 19.05,63.5 20.32,62.23 35.56,62.23 36.83,63.5 SLOT2.A13 39.37,63.5 40.64,62.23 55.88,62.23 57.15,63.5 SLOT3.A13 59.69,63.5 60.96,62.23 76.2,62.23 77.47,63.5 SLOT4.A13 80.01,63.5 81.28,62.23 96.52,62.23 97.79,63.5 SLOT5.A13 100.33,63.5 101.6,62.23 115.57,62.23 116.84,63.5 SLOT6.A13
X9
  Bottom 0.254: SLOT1.A14 19.05,60.96 20.32,59.69 35.56,59.69 36.83,60.96 SLOT2.A14 39.37,60.96 40.64,59.69 55.88,59.69 57.15,60.96 SLOT3.A14 59.69,60.96 60.96,59.69 76.2,59.69 77.47,60.96 SLOT4.A14 80.01,60.96 81.28,59.69 96.52,59.69 97.79,60.96 SLOT5.A14 100.33,60.96 101.6,59.69 115.57,59.69 116.84,60.96 SLOT6.A14
X10
  Bottom 0.254: SLOT1.A15 19.05,58.42 20.32,57.15 35.56,57.15 36.83,58.42 SLOT2.A15 39.37,58.42 40.64,57.15 55.88,57.15 57.15,58.42 SLOT3.A15 59.69,58.42 60.96,57.15 76.2,57.15 77.47,58.42 SLOT4.A15 80.01,58.42 81.28,57.15 96.52,57.15 97.79,58.42 SLOT5.A15 100.33,58.42 101.6,57.15 115.57,57.15 116.84,58.42 SLOT6.A15
X11
  Bottom 0.254: SLOT1.A16 19.05,55.88 20.32,54.61 35.56,54.61 36.83,55.88 SLOT2.A16 39.37,55.88 40.64,54.61 55.88,54.61 57.15,55.88 SLOT3.A16 59.69,55.88 60.96,54.61 76.2,54.61 77.47,55.88 SLOT4.A16 80.01,55.88 81.28,54.61 96.52,54.61 97.79,55.88 SLOT5.A16 100.33,55.88 101.6,54.61 115.57,54.61 116.84,55.88 SLOT6.A16
X12
  Bottom 0.254: SLOT1.A17 19.05,53.34 20.32,52.07 35.56,52.07 36.83,53.34 SLOT2.A17 39.37,53.34 40.64,52.07 55.88,52.07 57.15,53.34 SLOT3.A17 59.69,53.34 60.96,52.07 76.2,52.07 77.47,53.34 SLOT4.A17 80.01,53.34 81.28,52.07 96.52,52.07 97.79,53.34 SLOT5.A17 100.33,53.34 101.6,52.07 115.57,52.07 116.84,53.34 SLOT6.A17
X13
  Bottom 0.254: SLOT1.A18 19.05,50.8 20.32,49.53 35.56,49.53 36.83,50.8 SLOT2.A18 39.37,50.8 40.64,49.53 55.88,49.53 57.15,50.8 SLOT3.A18 59.69,50.8 60.96,49.53 76.2,49.53 77.47,50.8 SLOT4.A18 80.01,50.8 81.28,49.53 96.52,49.53 97.79,50.8 SLOT5.A18 100.33,50.8 101.6,49.53 115.57,49.53 116.84,50.8 SLOT6.A18
X14
  Bottom 0.254: SLOT1.A19 19.05,48.26 20.32,46.99 35.56,46.99 36.83,48.26 SLOT2.A19 39.37,48.26 40.64,46.99 55.88,46.99 57.15,48.26 SLOT3.A19 59.69,48.26 60.96,46.99 76.2,46.99 77.47,48.26 SLOT4.A19 80.01,48.26 81.28,46.99 96.52,46.99 97.79,48.26 SLOT5.A19 100.33,48.26 101.6,46.99 115.57,46.99 116.84,48.26 SLOT6.A19
X15
  Bottom 0.254: SLOT1.A20 19.05,45.72 20.32,44.45 35.56,44.45 36.83,45.72 SLOT2.A20 39.37,45.72 40.64,44.45 55.88,44.45 57.15,45.72 SLOT3.A20 59.69,45.72 60.96,44.45 76.2,44.45 77.47,45.72 SLOT4.A20 80.01,45.72 81.28,44.45 96.52,44.45 97.79,45.72 SLOT5.A20 100.33,45.72 101.6,44.45 115.57,44.45 116.84,45.72 SLOT6.A20
X16
  Bottom 0.254: SLOT1.A21 19.05,43.18 20.32,41.91 35.56,41.91 36.83,43.18 SLOT2.A21 39.37,43.18 40.64,41.91 55.88,41.91 57.15,43.18 SLOT3.A21 59.69,43.18 60.96,41.91 76.2,41.91 77.47,43.18 SLOT4.A21 80.01,43.18 81.28,41.91 96.52,41.91 97.79,43.18 SLOT5.A21 100.33,43.18 101.6,41.91 115.57,41.91 116.84,43.18 SLOT6.A21
X17
  Bottom 0.254: SLOT1.A22 19.05,40.64 20.32,39.37 35.56,39.37 36.83,40.64 SLOT2.A22 39.37,40.64 40.64,39.37 55.88,39.37 57.15,40.64 SLOT3.A22 59.69,40.64 60.96,39.37 76.2,39.37 77.47,40.64 SLOT4.A22 80.01,40.64 81.28,39.37 96.52,39.37 97.79,40.64 SLOT5.A22 100.33,40.64 101.6,39.37 115.57,39.37 116.84,40.64 SLOT6.A22
X18
  Bottom 0.254: SLOT1.A23 19.05,38.1 20.32,36.83 35.56,36.83 36.83,38.1 SLOT2.A23 39.37,38.1 40.64,36.83 55.88,36.83 57.15,38.1 SLOT3.A23 59.69,38.1 60.96,36.83 76.2,36.83 77.47,38.1 SLOT4.A23 80.01,38.1 81.28,36.83 96.52,36.83 97.79,38.1 SLOT5.A23 100.33,38.1 101.6,36.83 115.57,36.83 116.84,38.1 SLOT6.A23
X19
  Bottom 0.254: SLOT1.A24 19.05,35.56 20.32,34.29 35.56,34.29 36.83,35.56 SLOT2.A24 39.37,35.56 40.64,34.29 55.88,34.29 57.15,35.56 SLOT3.A24 59.69,35.56 60.96,34.29 76.2,34.29 77.47,35.56 SLOT4.A24 80.01,35.56 81.28,34.29 96.52,34.29 97.79,35.56 SLOT5.A24 100.33,35.56 101.6,34.29 115.57,34.29 116.84,35.56 SLOT6.A24
X20
  Bottom 0.254: SLOT1.A25 19.05,33.02 20.32,31.75 35.56,31.75 36.83,33.02 SLOT2.A25 39.37,33.02 40.64,31.75 55.88,31.75 57.15,33.02 SLOT3.A25 59.69,33.02 60.96,31.75 76.2,31.75 77.47,33.02 SLOT4.A25 80.01,33.02 81.28,31.75 96.52,31.75 97.79,33.02 SLOT5.A25 100.33,33.02 101.6,31.75 115.57,31.75 116.84,33.02 SLOT6.A25
X21
  Bottom 0.254: SLOT1.A26 19.05,30.48 20.32,29.21 35.56,29.21 36.83,30.48 SLOT2.A26 39.37,30.48 40.64,29.21 55.88,29.21 57.15,30.48 SLOT3.A26 59.69,30.48 60.96,29.21 76.2,29.21 77.47,30.48 SLOT4.A26 80.01,30.48 81.28,29.21 96.52,29.21 97.79,30.48 SLOT5.A26 100.33,30.48 101.6,29.21 115.57,29.21 116.84,30.48 SLOT6.A26
X22
  Bottom 0.254: SLOT1.A27 19.05,27.94 20.32,26.67 35.56,26.67 36.83,27.94 SLOT2.A27 39.37,27.94 40.64,26.67 55.88,26.67 57.15,27.94 SLOT3.A27 59.69,27.94 60.96,26.67 76.2,26.67 77.47,27.94 SLOT4.A27 80.01,27.94 81.28,26.67 96.52,26.67 97.79,27.94 SLOT5.A27 100.33,27.94 101.6,26.67 115.57,26.67 116.84,27.94 SLOT6.A27
X23
  Bottom 0.254: SLOT1.A28 19.05,25.4 20.32,24.13 35.56,24.13 36.83,25.4 SLOT2.A28 39.37,25.4 40.64,24.13 55.88,24.13 57.15,25.4 SLOT3.A28 59.69,25.4 60.96,24.13 76.2,24.13 77.47,25.4 SLOT4.A28 80.01,25.4 81.28,24.13 96.52,24.13 97.79,25.4 SLOT5.A28 100.33,25.4 101.6,24.13 115.57,24.13 116.84,25.4 SLOT6.A28
X24
  Bottom 0.254: SLOT1.A29 19.05,22.86 20.32,21.59 35.56,21.59 36.83,22.86 SLOT2.A29 39.37,22.86 40.64,21.59 55.88,21.59 57.15,22.86 SLOT3.A29 59.69,22.86 60.96,21.59 76.2,21.59 77.47,22.86 SLOT4.A29 80.01,22.86 81.28,21.59 96.52,21.59 97.79,22.86 SLOT5.A29 100.33,22.86 101.6,21.59 115.57,21.59 116.84,22.86 SLOT6.A29
X25
  Bottom 0.254: SLOT1.A30 19.05,20.32 20.32,19.05 35.56,19.05 36.83,20.32 SLOT2.A30 39.37,20.32 40.64,19.05 55.88,19.05 57.15,20.32 SLOT3.A30 59.69,20.32 60.96,19.05 76.2,19.05 77.47,20.32 SLOT4.A30 80.01,20.32 81.28,19.05 96.52,19.05 97.79,20.32 SLOT5.A30 100.33,20.32 101.6,19.05 115.57,19.05 116.84,20.32 SLOT6.A30
X26
  Bottom 0.254: SLOT1.A31 19.05,17.78 20.32,16.51 35.56,16.51 36.83,17.78 SLOT2.A31 39.37,17.78 40.64,16.51 55.88,16.51 57.15,17.78 SLOT3.A31 59.69,17.78 60.96,16.51 76.2,16.51 77.47,17.78 SLOT4.A31 80.01,17.78 81.28,16.51 96.52,16.51 97.79,17.78 SLOT5.A31 100.33,17.78 101.6,16.51 115.57,16.51 116.84,17.78 SLOT6.A31
X27
  Bottom 0.254: SLOT1.A32 19.05,15.24 20.32,13.97 35.56,13.97 36.83,15.24 SLOT2.A32 39.37,15.24 40.64,13.97 55.88,13.97 57.15,15.24 SLOT3.A32 59.69,15.24 60.96,13.97 76.2,13.97 77.47,15.24 SLOT4.A32 80.01,15.24 81.28,13.97 96.52,13.97 97.79,15.24 SLOT5.A32 100.33,15.24 101.6,13.97 115.57,13.97 116.84,15.24 SLOT6.A32
X28
  Bottom 0.254: SLOT1.A33 19.05,12.7 20.32,11.43 35.56,11.43 36.83,12.7 SLOT2.A33 39.37,12.7 40.64,11.43 55.88,11.43 57.15,12.7 SLOT3.A33 59.69,12.7 60.96,11.43 76.2,11.43 77.47,12.7 SLOT4.A33 80.01,12.7 81.28,11.43 96.52,11.43 97.79,12.7 SLOT5.A33 100.33,12.7 101.6,11.43 115.57,11.43 116.84,12.7 SLOT6.A33
X29
  Bottom 0.254: SLOT1.A34 19.05,10.16 20.32,8.89 35.56,8.89 36.83,10.16 SLOT2.A34 39.37,10.16 40.64,8.89 55.88,8.89 57.15,10.16 SLOT3.A34 59.69,10.16 60.96,8.89 76.2,8.89 77.47,10.16 SLOT4.A34 80.01,10.16 81.28,8.89 96.52,8.89 97.79,10.16 SLOT5.A34 100.33,10.16 101.6,8.89 115.57,8.89 116.84,10.16 SLOT6.A34
X30
  Bottom 0.254: SLOT6.B5 113.03,83.82 111.76,85.09 97.79,85.09 96.52,83.82 SLOT5.B5 81.28,83.82 80.01,85.09 76.2,85.09 74.93,83.82 SLOT4.B5 72.39,83.82 71.12,85.09 57.15,85.09 55.88,83.82 SLOT3.B5 52.07,83.82 50.8,85.09 36.83,85.09 35.56,83.82 SLOT2.B5 31.75,83.82 30.48,85.09 16.51,85.09 15.24,83.82 SLOT1.B5
X31
  Bottom 0.254: SLOT6.B6 104.14,81.28 102.87,82.55 97.79,82.55 96.52,81.28 SLOT5.B6 81.28,81.28 80.01,82.55 76.2,82.55 74.93,81.28 SLOT4.B6 63.5,81.28 62.23,82.55 57.15,82.55 55.88,81.28 SLOT3.B6 43.18,81.28 41.91,82.55 36.83,82.55 35.56,81.28 SLOT2.B6 31.75,81.28 30.48,82.55 16.51,82.55 15.24,81.28 SLOT1.B6
X32
  Bottom 0.254: SLOT6.B7 101.6,78.74 100.33,80.01 97.79,80.01 96.52,78.74 SLOT5.B7 81.28,78.74 80.01,80.01 76.2,80.01 74.93,78.74 SLOT4.B7 60.96,78.74 59.69,80.01 57.15,80.01 55.88,78.74 SLOT3.B7 40.64,78.74 39.37,80.01 36.83,80.01 35.56,78.74 SLOT2.B7 31.75,78.74 30.48,80.01 16.51,80.01 15.24,78.74 SLOT1.B7
X33
  Bottom 0.254: SLOT6.B8 101.6,76.2 100.33,77.47 97.79,77.47 96.52,76.2 SLOT5.B8 81.28,76.2 80.01,77.47 77.47,77.47 76.2,76.2 SLOT4.B8 60.96,76.2 59.69,77.47 57.15,77.47 55.88,76.2 SLOT3.B8 40.64,76.2 39.37,77.47 36.83,77.47 35.56,76.2 SLOT2.B8 29.21,76.2 27.94,77.47 16.51,77.47 15.24,76.2 SLOT1.B8
X34
  Bottom 0.254: SLOT6.B9 101.6,73.66 100.33,74.93 97.79,74.93 96.52,73.66 SLOT5.B9 81.28,73.66 80.01,74.93 77.47,74.93 76.2,73.66 SLOT4.B9 60.96,73.66 59.69,74.93 57.15,74.93 55.88,73.66 SLOT3.B9 40.64,73.66 39.37,74.93 36.83,74.93 35.56,73.66 SLOT2.B9 20.32,73.66 19.05,74.93 16.51,74.93 15.24,73.66 SLOT1.B9
X35
  Bottom 0.254: SLOT6.B10 101.6,71.12 100.33,72.39 97.79,72.39 96.52,71.12 SLOT5.B10 81.28,71.12 80.01,72.39 77.47,72.39 76.2,71.12 SLOT4.B10 60.96,71.12 59.69,72.39 57.15,72.39 55.88,71.12 SLOT3.B10 40.64,71.12 39.37,72.39 36.83,72.39 35.56,71.12 SLOT2.B10 20.32,71.12 19.05,72.39 16.51,72.39 15.24,71.12 SLOT1.B10
X36
  Bottom 0.254: SLOT6.B11 101.6,68.58 100.33,69.85 97.79,69.85 96.52,68.58 SLOT5.B11 81.28,68.58 80.01,69.85 77.47,69.85 76.2,68.58 SLOT4.B11 60.96,68.58 59.69,69.85 57.15,69.85 55.88,68.58 SLOT3.B11 40.64,68.58 39.37,69.85 36.83,69.85 35.56,68.58 SLOT2.B11 20.32,68.58 19.05,69.85 16.51,69.85 15.24,68.58 SLOT1.B11
X37
  Bottom 0.254: SLOT6.B12 101.6,66.04 100.33,67.31 97.79,67.31 96.52,66.04 SLOT5.B12 81.28,66.04 80.01,67.31 77.47,67.31 76.2,66.04 SLOT4.B12 60.96,66.04 59.69,67.31 57.15,67.31 55.88,66.04 SLOT3.B12 40.64,66.04 39.37,67.31 36.83,67.31 35.56,66.04 SLOT2.B12 20.32,66.04 19.05,67.31 16.51,67.31 15.24,66.04 SLOT1.B12
X38
  Bottom 0.254: SLOT6.B13 101.6,63.5 100.33,64.77 97.79,64.77 96.52,63.5 SLOT5.B13 81.28,63.5 80.01,64.77 77.47,64.77 76.2,63.5 SLOT4.B13 60.96,63.5 59.69,64.77 57.15,64.77 55.88,63.5 SLOT3.B13 40.64,63.5 39.37,64.77 36.83,64.77 35.56,63.5 SLOT2.B13 20.32,63.5 19.05,64.77 16.51,64.77 15.24,63.5 SLOT1.B13
X39
  Bottom 0.254: SLOT6.B14 101.6,60.96 100.33,62.23 97.79,62.23 96.52,60.96 SLOT5.B14 81.28,60.96 80.01,62.23 77.47,62.23 76.2,60.96 SLOT4.B14 60.96,60.96 59.69,62.23 57.15,62.23 55.88,60.96 SLOT3.B14 40.64,60.96 39.37,62.23 36.83,62.23 35.56,60.96 SLOT2.B14 20.32,60.96 19.05,62.23 16.51,62.23 15.24,60.96 SLOT1.B14
X40
  Bottom 0.254: SLOT6.B15 101.6,58.42 100.33,59.69 97.79,59.69 96.52,58.42 SLOT5.B15 81.28,58.42 80.01,59.69 77.47,59.69 76.2,58.42 SLOT4.B15 60.96,58.42 59.69,59.69 57.15,59.69 55.88,58.42 SLOT3.B15 40.64,58.42 39.37,59.69 36.83,59.69 35.56,58.42 SLOT2.B15 20.32,58.42 19.05,59.69 16.51,59.69 15.24,58.42 SLOT1.B15
X41
  Bottom 0.254: SLOT6.B16 101.6,55.88 100.33,57.15 97.79,57.15 96.52,55.88 SLOT5.B16 81.28,55.88 80.01,57.15 77.47,57.15 76.2,55.88 SLOT4.B16 60.96,55.88 59.69,57.15 57.15,57.15 55.88,55.88 SLOT3.B16 40.64,55.88 39.37,57.15 36.83,57.15 35.56,55.88 SLOT2.B16 20.32,55.88 19.05,57.15 16.51,57.15 15.24,55.88 SLOT1.B16
X42
  Bottom 0.254: SLOT6.B17 101.6,53.34 100.33,54.61 97.79,54.61 96.52,53.34 SLOT5.B17 81.28,53.34 80.01,54.61 77.47,54.61 76.2,53.34 SLOT4.B17 60.96,53.34 59.69,54.61 57.15,54.61 55.88,53.34 SLOT3.B17 40.64,53.34 39.37,54.61 36.83,54.61 35.56,53.34 SLOT2.B17 20.32,53.34 19.05,54.61 16.51,54.61 15.24,53.34 SLOT1.B17
X43
  Bottom 0.254: SLOT6.B18 101.6,50.8 100.33,52.07 97.79,52.07 96.52,50.8 SLOT5.B18 81.28,50.8 80.01,52.07 77.47,52.07 76.2,50.8 SLOT4.B18 60.96,50.8 59.69,52.07 57.15,52.07 55.88,50.8 SLOT3.B18 40.64,50.8 39.37,52.07 36.83,52.07 35.56,50.8 SLOT2.B18 20.32,50.8 19.05,52.07 16.51,52.07 15.24,50.8 SLOT1.B18
X44
  Bottom 0.254: SLOT6.B19 101.6,48.26 100.33,49.53 97.79,49.53 96.52,48.26 SLOT5.B19 81.28,48.26 80.01,49.53 77.47,49.53 76.2,48.26 SLOT4.B19 60.96,48.26 59.69,49.53 57.15,49.53 55.88,48.26 SLOT3.B19 40.64,48.26 39.37,49.53 36.83,49.53 35.56,48.26 SLOT2.B19 20.32,48.26 19.05,49.53 16.51,49.53 15.24,48.26 SLOT1.B19
X45
  Bottom 0.254: SLOT6.B20 101.6,45.72 100.33,46.99 97.79,46.99 96.52,45.72 SLOT5.B20 81.28,45.72 80.01,46.99 77.47,46.99 76.2,45.72 SLOT4.B20 60.96,45.72 59.69,46.99 57.15,46.99 55.88,45.72 SLOT3.B20 40.64,45.72 39.37,46.99 36.83,46.99 35.56,45.72 SLOT2.B20 20.32,45.72 19.05,46.99 16.51,46.99 15.24,45.72 SLOT1.B20
X46
  Bottom 0.254: SLOT6.B21 101.6,43.18 100.33,44.45 97.79,44.45 96.52,43.18 SLOT5.B21 81.28,43.18 80.01,44.45 77.47,44.45 76.2,43.18 SLOT4.B21 60.96,43.18 59.69,44.45 57.15,44.45 55.88,43.18 SLOT3.B21 40.64,43.18 39.37,44.45 36.83,44.45 35.56,43.18 SLOT2.B21 20.32,43.18 19.05,44.45 16.51,44.45 15.24,43.18 SLOT1.B21
X47
  Bottom 0.254: SLOT6.B22 101.6,40.64 100.33,41.91 97.79,41.91 96.52,40.64 SLOT5.B22 81.28,40.64 80.01,41.91 77.47,41.91 76.2,40.64 SLOT4.B22 60.96,40.64 59.69,41.91 57.15,41.91 55.88,40.64 SLOT3.B22 40.64,40.64 39.37,41.91 36.83,41.91 35.56,40.64 SLOT2.B22 20.32,40.64 19.05,41.91 16.51,41.91 15.24,40.64 SLOT1.B22
X48
  Bottom 0.254: SLOT6.B23 101.6,38.1 100.33,39.37 97.79,39.37 96.52,38.1 SLOT5.B23 81.28,38.1 80.01,39.37 77.47,39.37 76.2,38.1 SLOT4.B23 60.96,38.1 59.69,39.37 57.15,39.37 55.88,38.1 SLOT3.B23 40.64,38.1 39.37,39.37 36.83,39.37 35.56,38.1 SLOT2.B23 20.32,38.1 19.05,39.37 16.51,39.37 15.24,38.1 SLOT1.B23
X49
  Bottom 0.254: SLOT6.B24 101.6,35.56 100.33,36.83 97.79,36.83 96.52,35.56 SLOT5.B24 81.28,35.56 80.01,36.83 77.47,36.83 76.2,35.56 SLOT4.B24 60.96,35.56 59.69,36.83 57.15,36.83 55.88,35.56 SLOT3.B24 40.64,35.56 39.37,36.83 36.83,36.83 35.56,35.56 SLOT2.B24 20.32,35.56 19.05,36.83 16.51,36.83 15.24,35.56 SLOT1.B24
X50
  Bottom 0.254: SLOT6.B25 101.6,33.02 100.33,34.29 97.79,34.29 96.52,33.02 SLOT5.B25 81.28,33.02 80.01,34.29 77.47,34.29 76.2,33.02 SLOT4.B25 60.96,33.02 59.69,34.29 57.15,34.29 55.88,33.02 SLOT3.B25 40.64,33.02 39.37,34.29 36.83,34.29 35.56,33.02 SLOT2.B25 20.32,33.02 19.05,34.29 16.51,34.29 15.24,33.02 SLOT1.B25
X51
  Bottom 0.254: SLOT6.B26 101.6,30.48 100.33,31.75 97.79,31.75 96.52,30.48 SLOT5.B26 81.28,30.48 80.01,31.75 77.47,31.75 76.2,30.48 SLOT4.B26 60.96,30.48 59.69,31.75 57.15,31.75 55.88,30.48 SLOT3.B26 40.64,30.48 39.37,31.75 36.83,31.75 35.56,30.48 SLOT2.B26 20.32,30.48 19.05,31.75 16.51,31.75 15.24,30.48 SLOT1.B26
X52
  Bottom 0.254: SLOT6.B27 101.6,27.94 100.33,29.21 97.79,29.21 96.52,27.94 SLOT5.B27 81.28,27.94 80.01,29.21 77.47,29.21 76.2,27.94 SLOT4.B27 60.96,27.94 59.69,29.21 57.15,29.21 55.88,27.94 SLOT3.B27 40.64,27.94 39.37,29.21 36.83,29.21 35.56,27.94 SLOT2.B27 20.32,27.94 19.05,29.21 16.51,29.21 15.24,27.94 SLOT1.B27
X53
  Bottom 0.254: SLOT6.B28 101.6,25.4 100.33,26.67 97.79,26.67 96.52,25.4 SLOT5.B28 81.28,25.4 80.01,26.67 77.47,26.67 76.2,25.4 SLOT4.B28 60.96,25.4 59.69,26.67 57.15,26.67 55.88,25.4 SLOT3.B28 40.64,25.4 39.37,26.67 36.83,26.67 35.56,25.4 SLOT2.B28 20.32,25.4 19.05,26.67 16.51,26.67 15.24,25.4 SLOT1.B28
X54
  Bottom 0.254: SLOT6.B29 101.6,22.86 100.33,24.13 97.79,24.13 96.52,22.86 SLOT5.B29 81.28,22.86 80.01,24.13 77.47,24.13 76.2,22.86 SLOT4.B29 60.96,22.86 59.69,24.13 57.15,24.13 55.88,22.86 SLOT3.B29 40.64,22.86 39.37,24.13 36.83,24.13 35.56,22.86 SLOT2.B29 20.32,22.86 19.05,24.13 16.51,24.13 15.24,22.86 SLOT1.B29
X55
  Bottom 0.254: SLOT6.B30 101.6,20.32 100.33,21.59 97.79,21.59 96.52,20.32 SLOT5.B30 81.28,20.32 80.01,21.59 77.47,21.59 76.2,20.32 SLOT4.B30 60.96,20.32 59.69,21.59 57.15,21.59 55.88,20.32 SLOT3.B30 40.64,20.32 39.37,21.59 36.83,21.59 35.56,20.32 SLOT2.B30 20.32,20.32 19.05,21.59 16.51,21.59 15.24,20.32 SLOT1.B30
X56
  Bottom 0.254: SLOT6.B31 101.6,17.78 100.33,19.05 97.79,19.05 96.52,17.78 SLOT5.B31 81.28,17.78 80.01,19.05 77.47,19.05 76.2,17.78 SLOT4.B31 60.96,17.78 59.69,19.05 57.15,19.05 55.88,17.78 SLOT3.B31 40.64,17.78 39.37,19.05 36.83,19.05 35.56,17.78 SLOT2.B31 20.32,17.78 19.05,19.05 16.51,19.05 15.24,17.78 SLOT1.B31
X57
  Bottom 0.254: SLOT6.B32 101.6,15.24 100.33,16.51 97.79,16.51 96.52,15.24 SLOT5.B32 81.28,15.24 80.01,16.51 77.47,16.51 76.2,15.24 SLOT4.B32 60.96,15.24 59.69,16.51 57.15,16.51 55.88,15.24 SLOT3.B32 40.64,15.24 39.37,16.51 36.83,16.51 35.56,15.24 SLOT2.B32 20.32,15.24 19.05,16.51 16.51,16.51 15.24,15.24 SLOT1.B32
X58
  Bottom 0.254: SLOT6.B33 101.6,12.7 100.33,13.97 97.79,13.97 96.52,12.7 SLOT5.B33 81.28,12.7 80.01,13.97 77.47,13.97 76.2,12.7 SLOT4.B33 60.96,12.7 59.69,13.97 57.15,13.97 55.88,12.7 SLOT3.B33 40.64,12.7 39.37,13.97 36.83,13.97 35.56,12.7 SLOT2.B33 20.32,12.7 19.05,13.97 16.51,13.97 15.24,12.7 SLOT1.B33
X59
  Bottom 0.254: SLOT6.B34 101.6,10.16 100.33,11.43 97.79,11.43 96.52,10.16 SLOT5.B34 81.28,10.16 80.01,11.43 77.47,11.43 76.2,10.16 SLOT4.B34 60.96,10.16 59.69,11.43 57.15,11.43 55.88,10.16 SLOT3.B34 40.64,10.16 39.37,11.43 36.83,11.43 35.56,10.16 SLOT2.B34 20.32,10.16 19.05,11.43 16.51,11.43 15.24,10.16 SLOT1.B34

### Text on the board
tPlace: 5V/3A | Mini8086 Backplane 1.0 | SP 2020 | Slot 1 | Slot 2 | Slot 3 | Slot 4 | Slot 5 | Slot 6